# EAGLE schematic QL_keyboard (EAGLE 7.5.0)
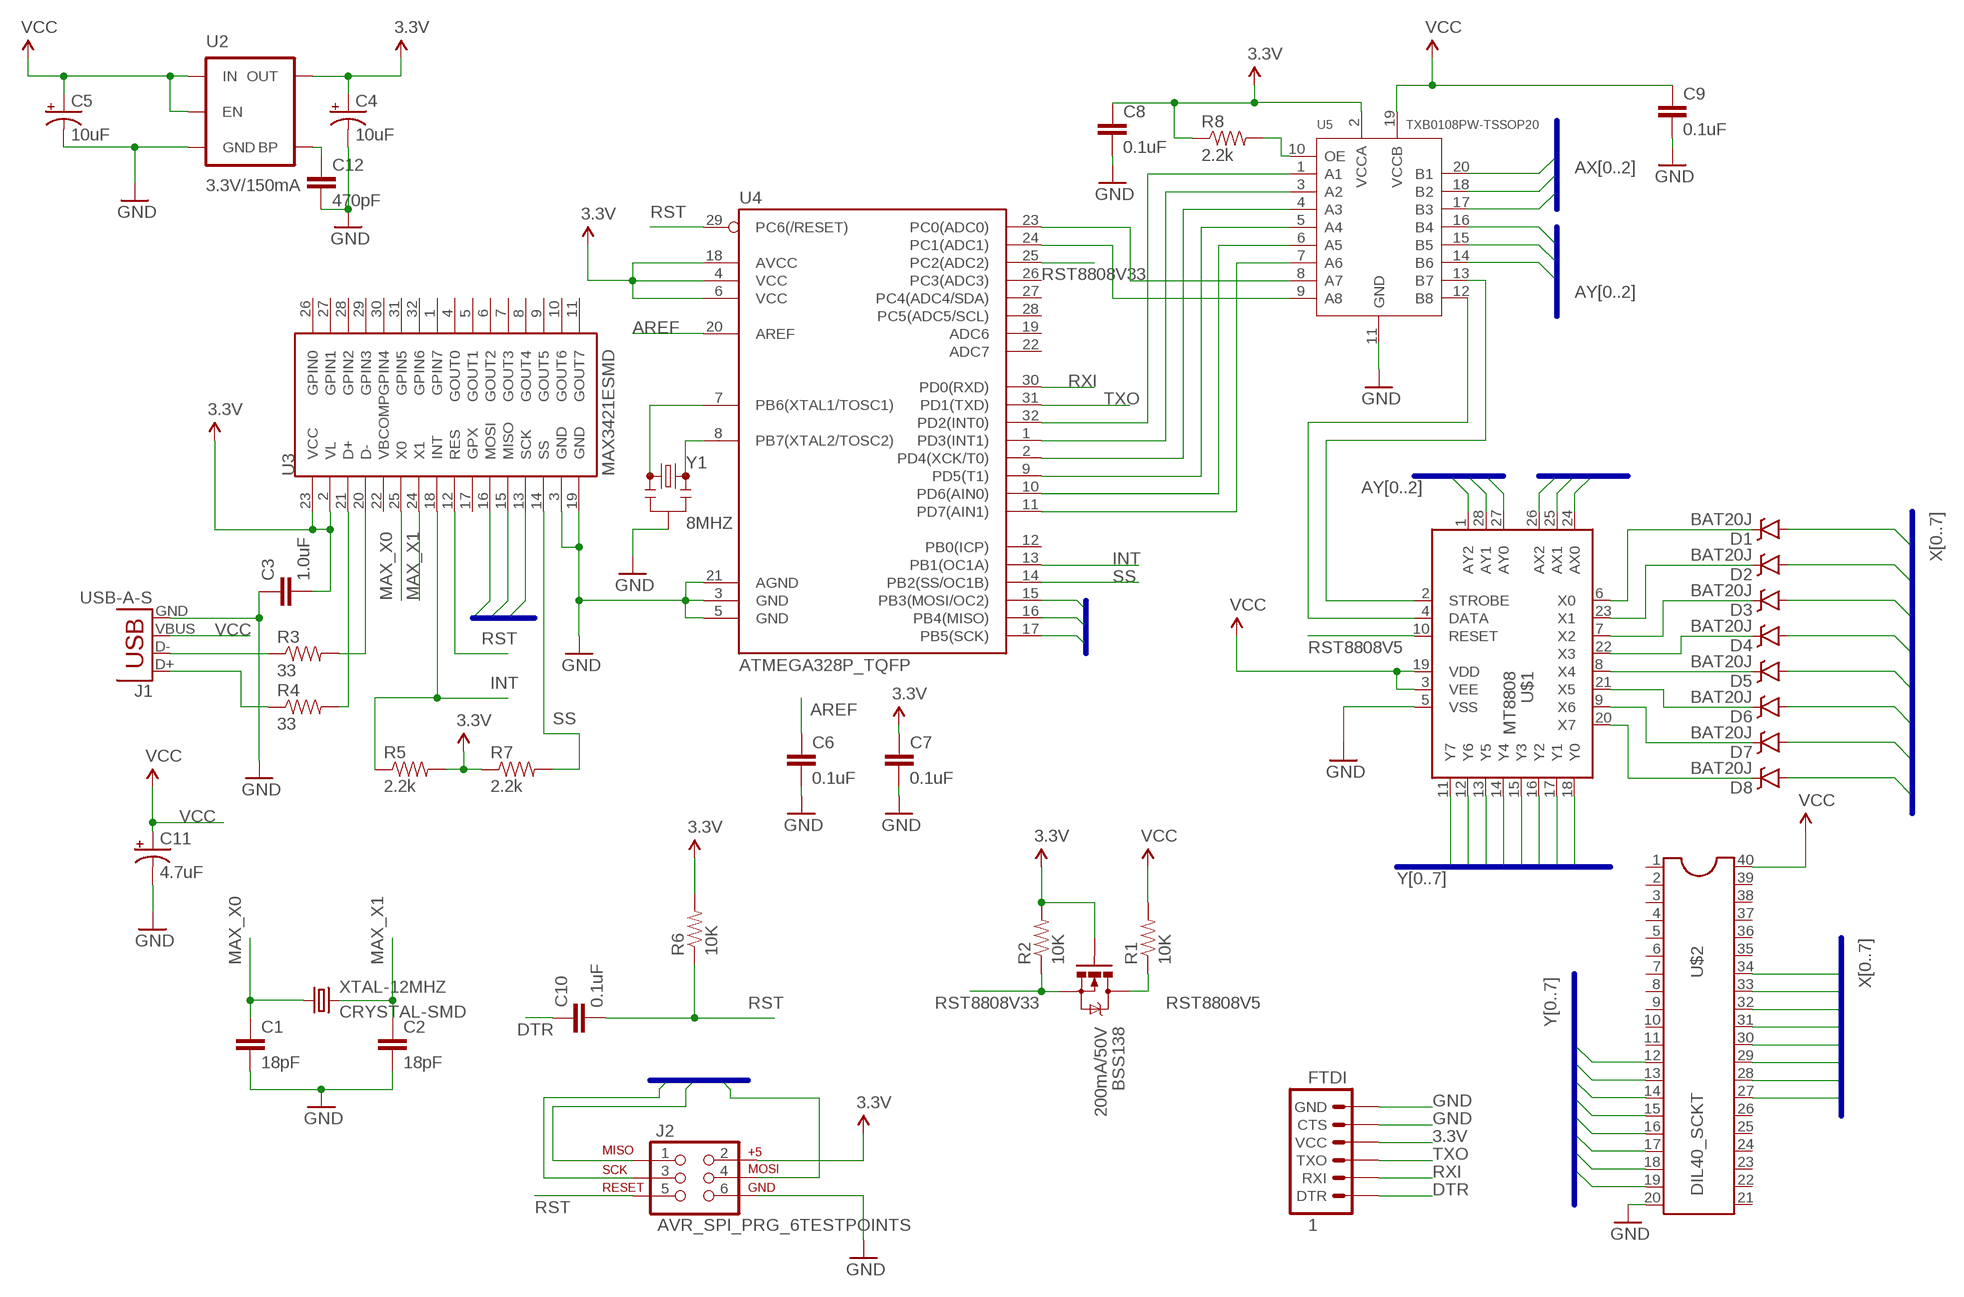
[diagram p0: schematic, sheet 1]

## Parts
BSS138  200mA/50V  MOSFET-NCHANNELBSS138  [SOT23-3]
C1  18pF  CAP0603-CAP  [0603-CAP]
C2  18pF  CAP0603-CAP  [0603-CAP]
C3  1.0uF  1.0UF-16V-10%(0603)  [0603-CAP]
C4  10uF  10UF-16V-10%(TANT)  [EIA3216]
C5  10uF  10UF-16V-10%(TANT)  [EIA3216]
C6  0.1uF  2.2UF-10V-20%(0603)  [0603-CAP]
C7  0.1uF  2.2UF-10V-20%(0603)  [0603-CAP]
C8  0.1uF  2.2UF-10V-20%(0603)  [0603-CAP]
C9  0.1uF  2.2UF-10V-20%(0603)  [0603-CAP]
C10  0.1uF  2.2UF-10V-20%(0603)  [0603-CAP]
C11  4.7uF  10UF-6.3V-20%(0603)(TANT)"  [0603-POL]
C12  470pF  2.2UF-10V-20%(0603)  [0603-CAP]
D1  BAT20J  DIODE-SCHOTTKY-BAT20J  [SOD-323]
D2  BAT20J  DIODE-SCHOTTKY-BAT20J  [SOD-323]
D3  BAT20J  DIODE-SCHOTTKY-BAT20J  [SOD-323]
D4  BAT20J  DIODE-SCHOTTKY-BAT20J  [SOD-323]
D5  BAT20J  DIODE-SCHOTTKY-BAT20J  [SOD-323]
D6  BAT20J  DIODE-SCHOTTKY-BAT20J  [SOD-323]
D7  BAT20J  DIODE-SCHOTTKY-BAT20J  [SOD-323]
D8  BAT20J  DIODE-SCHOTTKY-BAT20J  [SOD-323]
FTDI  1  ARDUINO_SERIAL_PROGRAMPTH  [1X06]
J1  USB-A-S  [USB-A-S]
J2  AVR_SPI_PRG_6TESTPOINTS  [2X3_TEST_POINTS]
R1  10K  10KOHM-1/10W-1%(0603)0603  [0603-RES]
R2  10K  10KOHM-1/10W-1%(0603)0603  [0603-RES]
R3  33  33OHM1/10W1%(0603)  [0603-RES]
R4  33  33OHM1/10W1%(0603)  [0603-RES]
R5  2.2k  2.2KOHM-1/10W-1%(0603)  [0603-RES]
R6  10K  10KOHM-1/10W-1%(0603)0603  [0603-RES]
R7  2.2k  2.2KOHM-1/10W-1%(0603)  [0603-RES]
R8  2.2k  2.2KOHM-1/10W-1%(0603)  [0603-RES]
U2  3.3V/150mA  V_REG_MIC52053.3V  [SOT23-5]
U3  MAX3421ESMD  [TQFP32-5MM]
U4  ATMEGA328P_TQFP  [TQFP32-08]
U5  TXB0108PW-TSSOP20  LOGIC-TXB0108PW(TSSOP20)  [TSSOP20-0.65-6.5X4.4MM]
U$1  MT8808  [S28]
U$2  DIL40_SCKT  [DIL40]
XTAL-12MHZ  CRYSTAL-SMD  [CRYSTAL-SMD-5X3.2]
Y1  8MHZ  RESONATOR8MHZ  [RESONATOR-SMD]

## Nets
3.3V: BSS138.1(G) C3.2 C4.A(+) C7.1 C8.1 FTDI.4(VCC) J2.2 R2.2 R5.2 R6.2 R7.1 R8.1 U2.5(OUT) U3.2(VL) U3.23(VCC) U4.4(VCC) U4.6(VCC) U4.18(AVCC) U5.2(VCCA)
AREF: C6.1 U4.20(AREF)
AVR_AX0: U4.32(PD2(INT0)) U5.1(A1)
AVR_AX1: U4.1(PD3(INT1)) U5.3(A2)
AVR_AX2: U4.2(PD4(XCK/T0)) U5.4(A3)
AVR_AY0: U4.9(PD5(T1)) U5.5(A4)
AVR_AY1: U4.10(PD6(AIN0)) U5.6(A5)
AVR_AY2: U4.11(PD7(AIN1)) U5.7(A6)
AVR_DATA: U4.24(PC1(ADC1)) U5.9(A8)
AVR_STROBE: U4.23(PC0(ADC0)) U5.8(A7)
AX0: U5.20(B1) U$1.24(AX0)
AX1: U5.18(B2) U$1.25(AX1)
AX2: U5.17(B3) U$1.26(AX2)
AY0: U5.16(B4) U$1.27(AY0)
AY1: U5.15(B5) U$1.28(AY1)
AY2: U5.14(B6) U$1.1(AY2)
DTR: C10.1 FTDI.1(DTR)
GND: C1.2 C2.2 C3.1 C4.C(-) C5.C(-) C6.2 C7.2 C8.2 C9.2 C11.K(-) C12.2 FTDI.5(CTS) FTDI.6(GND) J1.GND J2.6 U2.2(GND) U3.3(GND) U3.19(GND) U4.3(GND) U4.5(GND) U4.21(AGND) U5.11(GND) U$1.5(VSS) U$2.20 Y1.2
INT: R5.1 U3.18(INT) U4.13(PB1(OC1A))
MAX_X0: C1.1 U3.25(X0) XTAL-12MHZ.1
MAX_X1: C2.1 U3.24(X1) XTAL-12MHZ.2
MISO: J2.1 U3.15(MISO) U4.16(PB4(MISO))
MOSI: J2.4 U3.16(MOSI) U4.15(PB3(MOSI/OC2))
N$1: J1.D- R3.1
N$2: R3.2 U3.20(D-)
N$3: R4.2 U3.21(D+)
N$4: J1.D+ R4.1
N$5: C12.1 U2.4(BP)
N$13: U5.12(B8) U$1.4(DATA)
N$14: U5.13(B7) U$1.2(STROBE)
N$15: U4.8(PB7(XTAL2/TOSC2)) Y1.3
N$16: U4.7(PB6(XTAL1/TOSC1)) Y1.1
N$17: R8.2 U5.10(OE)
N$19: D1.C U$1.6(X0)
N$20: D2.C U$1.23(X1)
N$21: D3.C U$1.7(X2)
N$22: D4.C U$1.22(X3)
N$23: D5.C U$1.8(X4)
N$24: D6.C U$1.21(X5)
N$25: D7.C U$1.9(X6)
N$26: D8.C U$1.20(X7)
RST: C10.2 J2.5 R6.1 U3.12(RES) U4.29(PC6(/RESET))
RST8808V5: BSS138.3(D) R1.1 U$1.10(RESET)
RST8808V33: BSS138.2(S) R2.1 U4.25(PC2(ADC2))
RXI: FTDI.2(RXI) U4.30(PD0(RXD))
SCK: J2.3 U3.13(SCK) U4.17(PB5(SCK))
SS: R7.2 U3.14(SS) U4.14(PB2(SS/OC1B))
TXO: FTDI.3(TXO) U4.31(PD1(TXD))
VCC: C5.A(+) C9.1 C11.A(+) J1.VBUS R1.2 U2.1(IN) U2.3(EN) U5.19(VCCB) U$1.3(VEE) U$1.19(VDD) U$2.40
X0: D1.A U$2.27
X1: D2.A U$2.28
X2: D3.A U$2.29
X3: D4.A U$2.30
X4: D5.A U$2.31
X5: D6.A U$2.32
X6: D7.A U$2.33
X7: D8.A U$2.34
Y0: U$1.18(Y0) U$2.12
Y1: U$1.17(Y1) U$2.13
Y2: U$1.16(Y2) U$2.14
Y3: U$1.15(Y3) U$2.15
Y4: U$1.14(Y4) U$2.16
Y5: U$1.13(Y5) U$2.17
Y6: U$1.12(Y6) U$2.18
Y7: U$1.11(Y7) U$2.19
Unconnected: U3.1(GPIN7) U3.4(GOUT0) U3.5(GOUT1) U3.6(GOUT2) U3.7(GOUT3) U3.8(GOUT4) U3.9(GOUT5) U3.10(GOUT6) U3.11(GOUT7) U3.17(GPX) U3.22(VBCOMP) U3.26(GPIN0) U3.27(GPIN1) U3.28(GPIN2) U3.29(GPIN3) U3.30(GPIN4) U3.31(GPIN5) U3.32(GPIN6) U4.12(PB0(ICP)) U4.19(ADC6) U4.22(ADC7) U4.26(PC3(ADC3)) U4.27(PC4(ADC4/SDA)) U4.28(PC5(ADC5/SCL)) U$2.1 U$2.2 U$2.3 U$2.4 U$2.5 U$2.6 U$2.7 U$2.8 U$2.9 U$2.10 U$2.11 U$2.21 U$2.22 U$2.23 U$2.24 U$2.25 U$2.26 U$2.35 U$2.36 U$2.37 U$2.38 U$2.39

## Buses
Y[0..7]
X[0..7]
AX[0..2]
AY[0..2]
MOSI,MISO,SCK

## Library data of the parts
BSS138 = SparkFun-DiscreteSemi:MOSFET-NCHANNEL: Common NMOSFET Parts MFG P/N Store ID Prod ID FDD8780 TRANS-09984 SI7820DN TRANS-11055 FDS6630A IC-08089 2N7002PW TRANS-11151 FQP30N06L COM-10213 TRANS-10060 BSS123LT1G TRANS-08345 BSS138 TRANS-00830 BS170 2N7000; PROD_ID: TRANS-00830
C1 C2 = SparkFun-Passives:CAP: Capacitor Standard 0603 ceramic capacitor, and 0.1" leaded capacitor.
C3 = SparkFun-Capacitors:1.0UF-16V-10%(0603): CAP-00868; PROD_ID: CAP-00868
C4 C5 = SparkFun-Capacitors:10UF-16V-10%(TANT): CAP-00811 1206/EIA-3216 Tantalum capacitor; PROD_ID: CAP-00811
C6-C10 C12 = SparkFun-Capacitors:2.2UF-10V-20%(0603): CAP-07888; PROD_ID: CAP-07888; VALUE: 2.2uF
C11 = SparkFun-Capacitors:10UF-6.3V-20%(0603)(TANT); PROD_ID: CAP-13210; VALUE: 10uF
D1-D8 = SparkFun-DiscreteSemi:DIODE-SCHOTTKY: Schottky diodes in SFE's production catalog BAT20J 1A 23V 0.62Vf RB751 120mA 40V 0.37Vf PMEG4005EJ 0.5A 40V 0.42Vf MBRA140 1A 40V 0.5Vf B340A 3A 40V SMA; PROD_ID: DIO-11623
FTDI = SparkFun-Connectors:ARDUINO_SERIAL_PROGRAM: FTDI connector footprints
J1 = SparkFun-Connectors:USB: USB Connectors USB-B-PTH is fully proven SKU : PRT-00139/CONN-08278 USB-miniB is fully proven SKU : PRT-00587 USB-A-PCB is untested. USB-A-H is throughly reviewed, but untested. Spark Fun Electronics SKU : PRT-00437 USB-B-SMT is throughly reviewed, but untested. Needs silkscreen touching up. USB-A-S has not been used/tested USB-MB-H has not been used/tested USB-MICROB has been used. CONN-09505
J2 = SparkFun-Connectors:AVR_SPI_PRG_6: AVR ISP 6 Pin This is the reduced ISP connector for AVR programming. Common on Arduino. This footprint will take up less PCB space and can be used with a 10-pin to 6-pin adapter such as SKU: BOB-08508 **Special note about "TEST_POINT" package. The stop mask is on the top side, so if you want your programming test points to be on the bottom of your board, make sure to place this package on the bottom side of the board. This also ensure that the orientation to program from the bottom side will be correct.
R1 R2 R6 = SparkFun-Resistors:10KOHM-1/10W-1%(0603): RES-00824; PROD_ID: RES-00824
R3 R4 = SparkFun-Resistors:33OHM1/10W1%(0603): RES-08270; PROD_ID: RES-08270
R5 R7 R8 = SparkFun-Resistors:2.2KOHM-1/10W-1%(0603): RES-08272; PROD_ID: RES-08272
U2 = SparkFun-PowerIC:V_REG_MIC5205: V_REG MIC5205 Standard 3.3V, 5V, and Adjustable 150mA LDO voltage regulator in SOT-23 layout. Micrel part MIC5205. BP (by-pass) pin is used to lower output noise with 470pF cap, may be left open. On the adjustable version BP is used to set output.; PROD_ID: VREG-00822
U3 = SparkFun-DigitalIC:MAX3421E: USB Peripheral/Host Controller w/ SPI
U4 = SparkFun-DigitalIC:ATMEGA328P_TQFP; PROD_ID: IC-09069
U5 = Seeed-OPL-ic:LOGIC-TXB0108PW(TSSOP20): 310050024; MPN: TXB0108PW
U$1 = ppe_custom:MT8808
U$2 = ppe_custom:DIL40_SCKT
XTAL-12MHZ = ppe_custom:CRYSTAL-SMD: CTS Model 445 SMD Quartz DS http://www.mouser.com/ds/2/96/008-0360-0-786290.pdf
Y1 = SparkFun-FreqCtrl:RESONATOR: Resonator Small SMD resonator. Used, eg, on the Arduino Pro/ Pro Mini boards. 8MHz- XTAL-08895 16MHz- XTAL-08900; PROD_ID: XTAL-08895